# EAGLE schematic Senaino (EAGLE 9.5.1)
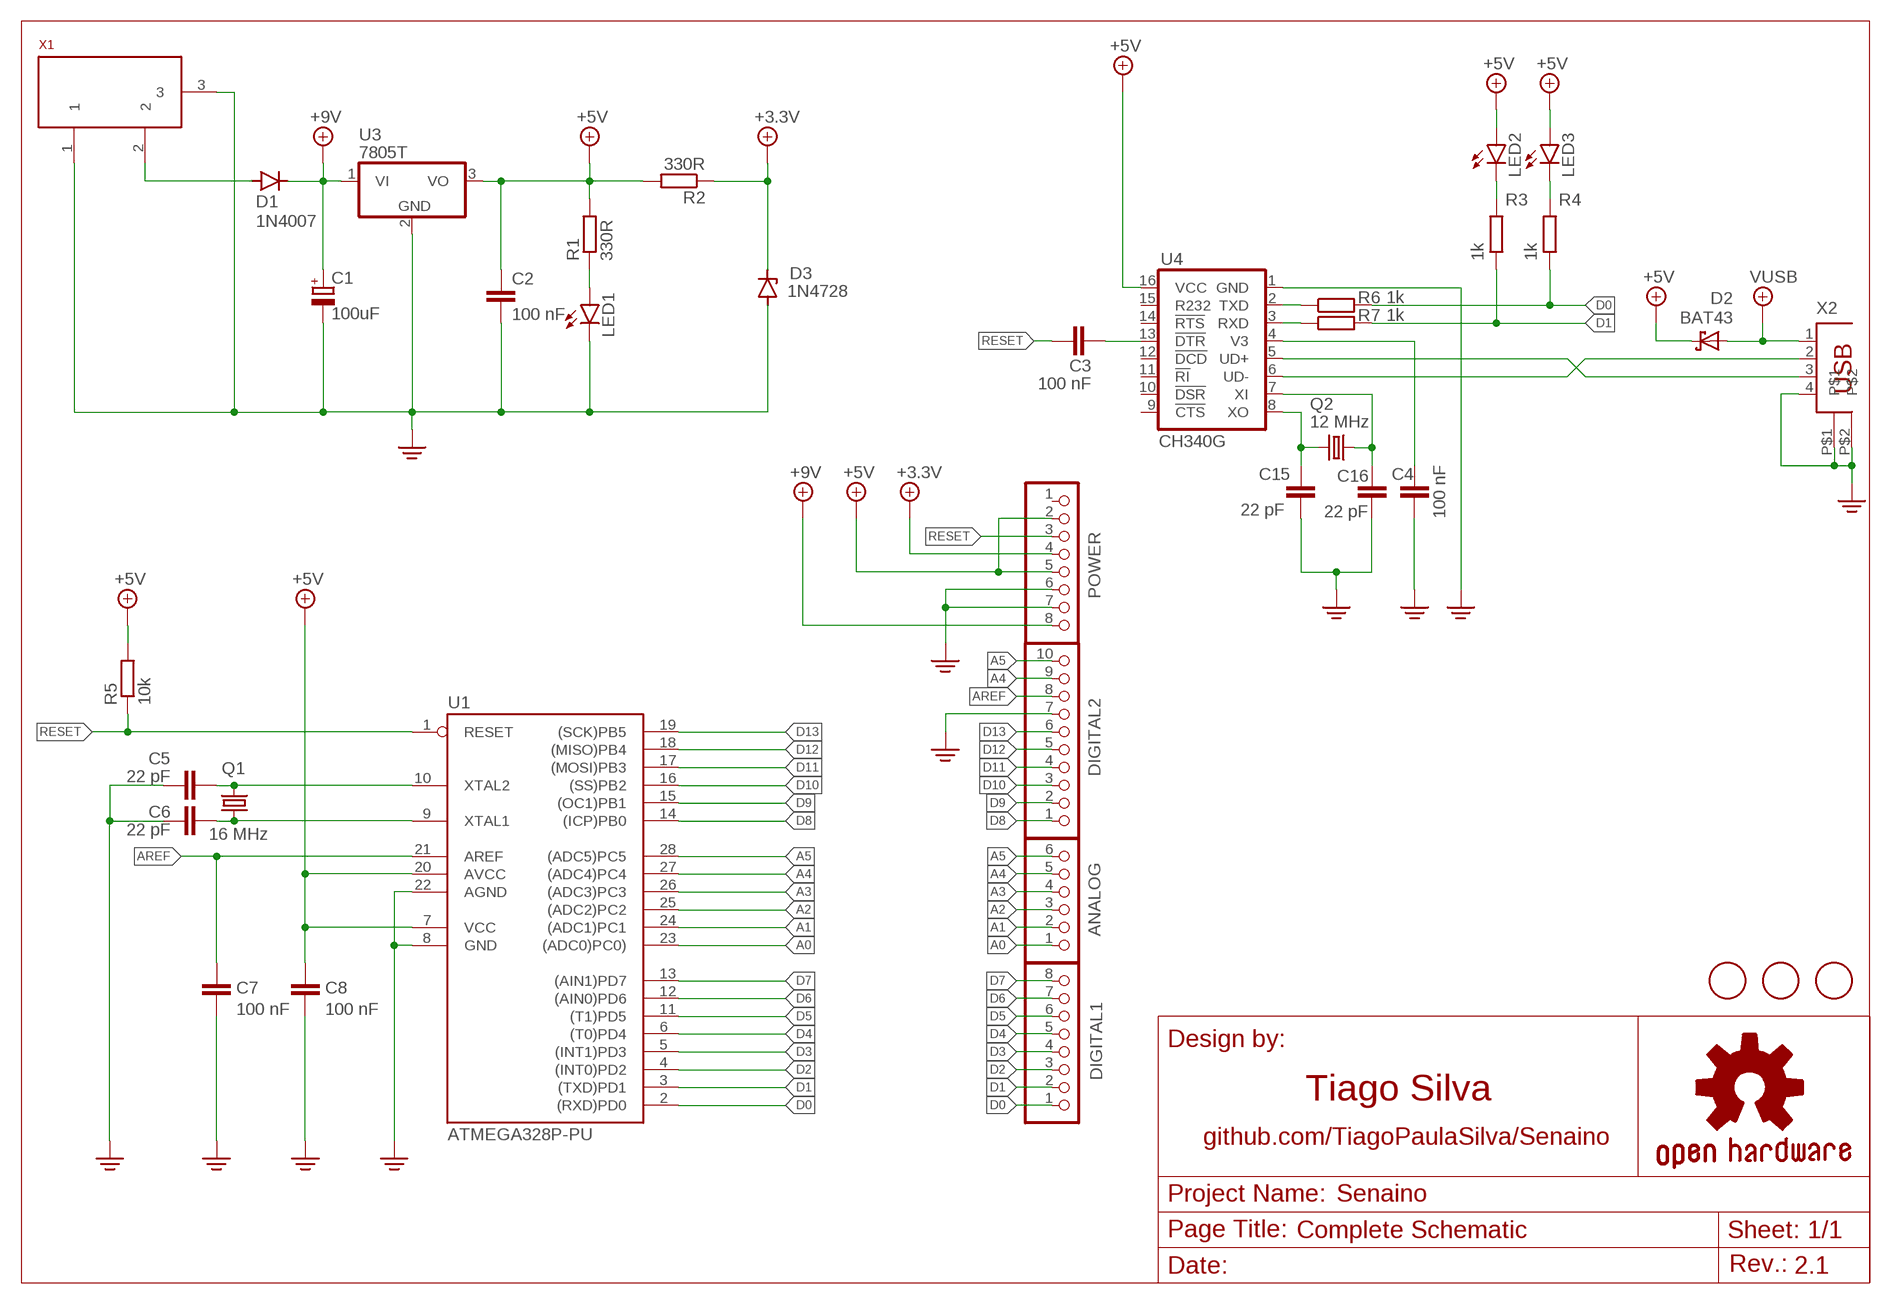
[diagram p0: schematic, sheet 1]

## Parts
ANALOG  PINHD-1X6  [1X06]
C1  100uF  CPOL-EUE2-5  [E2-5]
C2  100 nF  C-EU025-024X044  [C025-024X044]
C3  100 nF  C-EU025-024X044  [C025-024X044]
C4  100 nF  C-EU025-024X044  [C025-024X044]
C5  22 pF  C-EU025-024X044  [C025-024X044]
C6  22 pF  C-EU025-024X044  [C025-024X044]
C7  100 nF  C-EU025-024X044  [C025-024X044]
C8  100 nF  C-EU025-024X044  [C025-024X044]
C15  22 pF  C-EU025-024X044  [C025-024X044]
C16  22 pF  C-EU025-024X044  [C025-024X044]
D1  1N4007  1N4148DO35-7  [DO35-7]
D2  BAT43  SCHOTTKY-DIODEDO35-7  [DIODE_DO35-7]
D3  1N4728  [DO41Z10]
DIGITAL1  PINHD-1X8  [1X08]
DIGITAL2  PINHD-1X10_ARD  [1X10]
FD1  FIDUCIALMOUNT  [FIDUCIA-MOUNT]
FD2  FIDUCIALMOUNT  [FIDUCIA-MOUNT]
FD3  FIDUCIALMOUNT  [FIDUCIA-MOUNT]
LED1  LED3MM  [LED3MM]
LED2  LED3MM  [LED3MM]
LED3  LED3MM  [LED3MM]
POWER  PINHD-1X8  [1X08]
Q1  16 MHz  CRYSTALHC49S  [HC49/S]
Q2  12 MHz  CRYSTALHC49S  [HC49/S]
R1  330R  R-EU_0204/7  [0204/7]
R2  330R  R-EU_0204/7  [0204/7]
R3  1k  R-EU_0204/7  [0204/7]
R4  1k  R-EU_0204/7  [0204/7]
R5  10k  R-EU_0204/7  [0204/7]
R6  1k  R-EU_0204/7  [0204/7]
R7  1k  R-EU_0204/7  [0204/7]
U1  ATMEGA328P-PU  [DIL28-3]
U3  7805T  [TO220H]
U4  CH340G  CH340GSMD  [SO016]
X1  POWERSUPPLY_DC21MMX  [POWERSUPPLY_DC-21MM]
X2  PN61729  [PN61729]

## Nets
+3.3V: D3.C POWER.4 R2.1
+5V: C2.1 C8.1 D2.C(A) LED2.A LED3.A POWER.2 POWER.5 R1.2 R2.2 R5.2 U1.7(VCC) U1.20(AVCC) U3.3(VO) U4.16(VCC)
+9V: C1.+ D1.C POWER.8 U3.1(VI)
A0: ANALOG.1 U1.23((ADC0)PC0))
A1: ANALOG.2 U1.24((ADC1)PC1)
A2: ANALOG.3 U1.25((ADC2)PC2)
A3: ANALOG.4 U1.26((ADC3)PC3)
A4: ANALOG.5 DIGITAL2.9 U1.27((ADC4)PC4)
A5: ANALOG.6 DIGITAL2.10 U1.28((ADC5)PC5)
AREF: C7.1 DIGITAL2.8 U1.21(AREF)
D0: DIGITAL1.1 R4.1 R6.2 U1.2((RXD)PD0)
D1: DIGITAL1.2 R3.1 R7.2 U1.3((TXD)PD1)
D2: DIGITAL1.3 U1.4((INT0)PD2)
D3: DIGITAL1.4 U1.5((INT1)PD3)
D4: DIGITAL1.5 U1.6((T0)PD4)
D5: DIGITAL1.6 U1.11((T1)PD5)
D6: DIGITAL1.7 U1.12((AIN0)PD6)
D7: DIGITAL1.8 U1.13((AIN1)PD7)
D8: DIGITAL2.1 U1.14((ICP)PB0)
D9: DIGITAL2.2 U1.15((OC1)PB1)
D10: DIGITAL2.3 U1.16((SS)PB2)
D11: DIGITAL2.4 U1.17((MOSI)PB3)
D12: DIGITAL2.5 U1.18((MISO)PB4)
D13: DIGITAL2.6 U1.19((SCK)PB5)
GND [gnd]: C1.- C2.2 C4.1 C5.1 C6.1 C7.2 C8.2 C15.1 C16.1 D3.A DIGITAL2.7 LED1.K(C) POWER.6 POWER.7 U1.8(GND) U1.22(AGND) U3.2(GND) U4.1(GND) X1.1 X1.3 X2.4 X2.P$1 X2.P$2
N$1: D1.A X1.2
N$2: U4.5(UD+) X2.3
N$3: C3.2 U4.13(!DTR)
N$4: R6.1 U4.2(TXD)
N$5: U4.6(UD-) X2.2
N$8: LED2.K(C) R3.2
N$9: LED3.K(C) R4.2
N$10: R7.1 U4.3(RXD)
N$11: C4.2 U4.4(V3)
N$12: C15.2 Q2.2 U4.8(XO)
N$13: C16.2 Q2.1 U4.7(XI)
N$29: C5.2 Q1.2 U1.10(XTAL2)
N$30: C6.2 Q1.1 U1.9(XTAL1)
N$31: LED1.A R1.1
RESET: C3.1 POWER.3 R5.1 U1.1(RESET)
VUSB: D2.A(C) X2.1
Unconnected: POWER.1 U4.9(!CTS) U4.10(!DSR) U4.11(!RI) U4.12(!DCD) U4.14(!RTS) U4.15(R232)

## Notes on the sheet
- Tiago Silva
- github.com/TiagoPaulaSilva/Senaino
- Complete Schematic
- 2.1

## Library data of the parts
ANALOG = SmartPrj:PINHD-1X6: PIN HEADER
C1 = rcl:CPOL-EU: POLARIZED CAPACITOR, European symbol; SPICEPREFIX: C
C2-C8 C15 C16 = rcl:C-EU: CAPACITOR, European symbol; SPICEPREFIX: C
D1 = diode:1N4148: DIODE high speed (Philips)
D2 = eagle-ltspice:SCHOTTKY-DIODE: Schottky Diode; SPICEMODEL: NONE; SPICEPREFIX: D; SPICETYPE: diode
D3 = diode:1N4728: Z DIODE 3.3 V, 1W, 5 percent
DIGITAL1 POWER = SmartPrj:PINHD-1X8: PIN HEADER
DIGITAL2 = SmartPrj:PINHD-1X10_ARD: PIN HEADER
FD1-FD3 = SmartPrj:FIDUCIALMOUNT
LED1-LED3 = led:LED: LED OSRAM: - CHIPLED LG R971, LG N971, LY N971, LG Q971, LY Q971, LO R971, LY R971 LH N974, LH R974 LS Q976, LO Q976, LY Q976 LO Q996 - Hyper CHIPLED LW Q18S LB Q993, LB Q99A, LB R99A - SideLED LS A670, LO A670, LY A670, LG A670, LP A670 LB A673, LV A673, LT A673, LW A673 LH A674 LY A675 LS A676, LA A676, LO A676, LY A676, LW A676 LS A679, LY A679, LG A679 - Hyper Micro SIDELED® LS Y876, LA Y876, LO Y876, LY Y876 LT Y87S - SmartLED LW L88C, LW L88S LB L89C, LB L89S, LG L890 LS L89K, LO L89K, LY L89K LS L896, LA L896, LO L896, LY L896 - TOPLED LS T670, LO T670, LY T670, LG T670, LP T670 LSG T670, LSP T670, LSY T670, LOP T670, LYG T670 LG T671, LOG T671, LSG T671 LB T673, LV T673, LT T673, LW T673 LH T674 LS T676, LA T676, LO T676, LY T676, LB T676, LH T676, LSB T676, LW T676 LB T67C, LV T67C, LT T67C, LS T67K, LO T67K, LY T67K, LW E67C LS E67B, LA E67B, LO E67B, LY E67B, LB E67C, LV E67C, LT E67C LW T67C LS T679, LY T679, LG T679 LS T770, LO T770, LY T770, LG T770, LP T770 LB T773, LV T773, LT T773, LW T773 LH T774 LS E675, LA E675, LY E675, LS T675 LS T776, LA T776, LO T776, LY T776, LB T776 LHGB T686 LT T68C, LB T68C - Hyper Mini TOPLED® LB M676 - Mini TOPLED Santana® LG M470 LS M47K, LO M47K, LY M47K Source: http://www.osram.convergy.de LUXEON: - LUMILED® LXK2-PW12-R00, LXK2-PW12-S00, LXK2-PW14-U00, LXK2-PW14-V00 LXK2-PM12-R00, LXK2-PM12-S00, LXK2-PM14-U00 LXK2-PE12-Q00, LXK2-PE12-R00, LXK2-PE12-S00, LXK2-PE14-T00, LXK2-PE14-U00 LXK2-PB12-K00, LXK2-PB12-L00, LXK2-PB12-M00, LXK2-PB14-N00, LXK2-PB14-P00, LXK2-PB14-Q00 LXK2-PR12-L00, LXK2-PR12-M00, LXK2-PR14-Q00, LXK2-PR14-R00 LXK2-PD12-Q00, LXK2-PD12-R00, LXK2-PD12-S00 LXK2-PH12-R00, LXK2-PH12-S00 LXK2-PL12-P00, LXK2-PL12-Q00, LXK2-PL12-R00 Source: www.luxeon.com KINGBRIGHT: KA-3528ASYC Source: www.kingbright.com
Q1 Q2 = crystal:CRYSTAL: CRYSTAL; OC_FARNELL: 1667008; OC_NEWARK: unknown
R1-R7 = rcl:R-EU_: RESISTOR, European symbol; SPICEPREFIX: R
U1 = SmartPrj:ATMEGA328P-: MICROCONTROLLER 4 Kbytes FLASH 128 bytes SRAM 256 bytes EEPROM UART 6-channel 10 bit ADC
U3 = linear:78*: Positive VOLTAGE REGULATOR Source: http://cache.national.com/ds/LM/LM78L05.pdf http://www.fairchildsemi.com/ds/LM/LM7805.pdf
U4 = Serial-Basic:CH340G: A simple USB 2.0 to Serial IC.; PROD_ID: IC-13498
X1 = SmartPrj:POWERSUPPLY_DC21MM
X2 = SmartPrj:PN61729: BERG USB connector

## Net classes
0 default: width 0.254 mm, clearance 0.254 mm
1 power: width 0.61 mm, drill 0.61 mm, clearance 0.254 mm
2 gnd: width 0.305 mm, drill 0.559 mm, clearance 0.254 mm
3 usbvcc: width 0.508 mm, drill 0.61 mm, clearance 0.254 mm
4 aref: width 0.406 mm, drill 0.61 mm, clearance 0.254 mm